# EAGLE design driver (EAGLE 5.10)
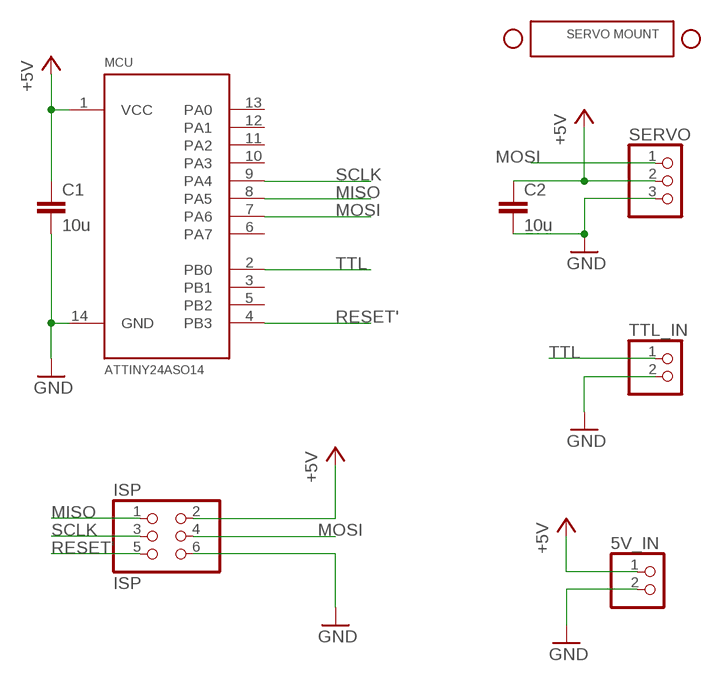
[diagram p0: schematic, sheet 1]

## Parts
5V_IN  PINHD-1X2/90  [1X02/90]
C1  10u  C-EUC0805  [C0805]
C2  10u  C-EUC0805  [C0805]
ISP  ISP  PINHD-2X3  [2X03]
MCU  ATTINY24ASO14  [SO14]
SERVO  PINHD-1X3/90  [1X03/90]
TTL_IN  PINHD-1X2/90  [1X02/90]
U$2  HYPERIONDS09  [HYPERIONDS09]

## Nets
+5V: 5V_IN.1 C1.1 C2.1 ISP.2 MCU.1(VCC) SERVO.2
GND: 5V_IN.2 C1.2 C2.2 ISP.6 MCU.14(GND) SERVO.3 TTL_IN.2
MISO: ISP.1 MCU.8(PA5)
MOSI: ISP.4 MCU.7(PA6) SERVO.1
RESET': ISP.5 MCU.4(PB3)
SCLK: ISP.3 MCU.9(PA4)
TTL: MCU.2(PB0) TTL_IN.1
Unconnected: MCU.3(PB1) MCU.5(PB2) MCU.6(PA7) MCU.10(PA3) MCU.11(PA2) MCU.12(PA1) MCU.13(PA0)

## Library data of the parts
5V_IN TTL_IN = pinhead:PINHD-1X2: PIN HEADER
C1 C2 = resistor:C-EU: CAPACITOR, European symbol
ISP = pinhead:PINHD-2X3: PIN HEADER
MCU = custom_parts:ATTINY24A
SERVO = pinhead:PINHD-1X3: PIN HEADER
U$2 = custom_parts:HYPERIONDS09

## Board
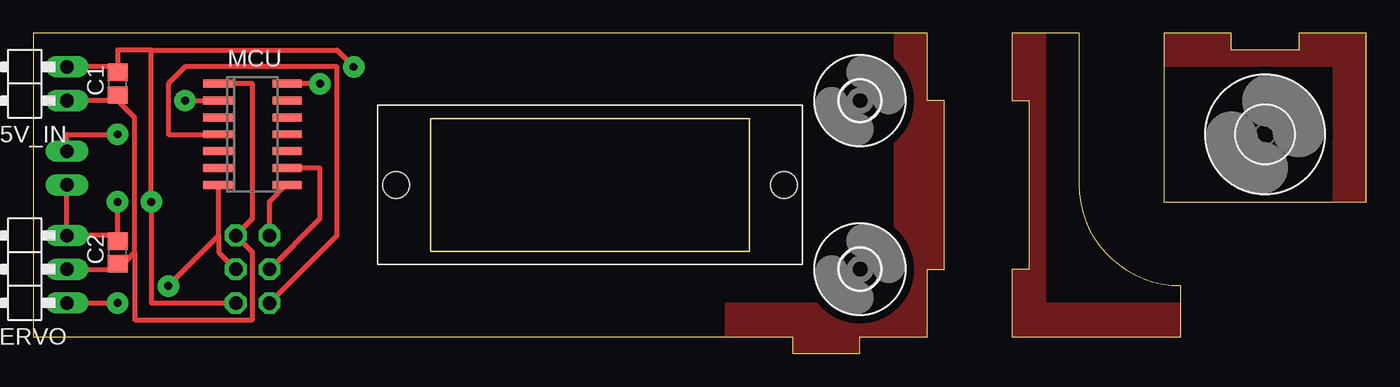
[diagram p1: board, top side]
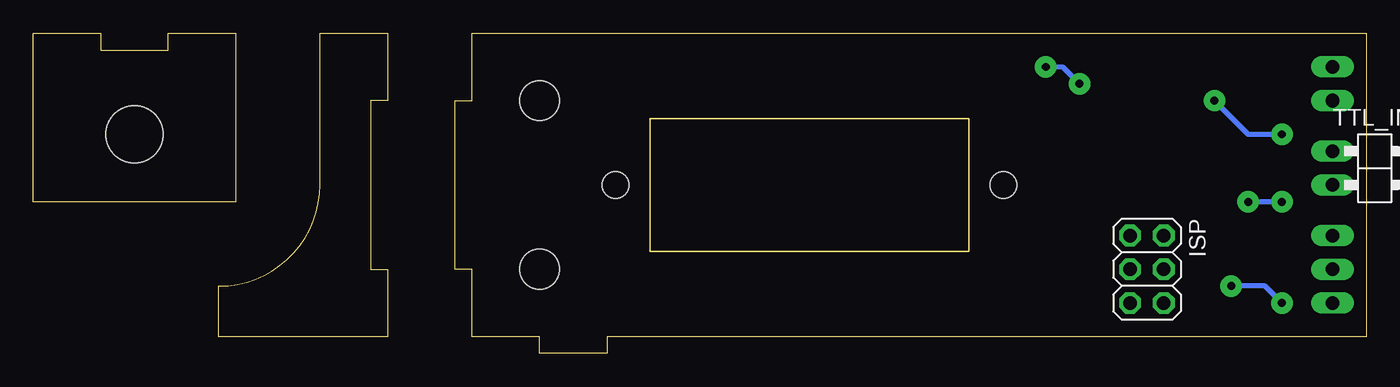
[diagram p2: board, bottom side, seen from below]

Size 100.33 x 24.13 mm. Coordinates in mm from the lower left corner, seen from the top.
Outline: 73.66,24.13 73.66,19.05 74.93,19.05 74.93,6.35 73.66,6.35 73.66,1.27 86.36,1.27 86.36,5.08 arc-90 78.74,12.7 78.74,24.13 73.66,24.13
Outline: 100.33,24.13 95.25,24.13 95.25,22.86 90.17,22.86 90.17,24.13 85.09,24.13 85.09,11.43 100.33,11.43 100.33,24.13
Outline: 0,1.27 57.15,1.27 57.15,0 62.23,0 62.23,1.27 67.31,1.27 67.31,6.35 68.58,6.35 68.58,19.05 67.31,19.05 67.31,24.13 0,24.13 0,1.27
Copper layers (1*16): Top 0.035mm / dielectric 1.5mm / Bottom 0.035mm
Design rules "default *": minimum track width 15mil, minimum drill 0.6mm, track to track 10mil, track to pad 10mil, pad to pad 10mil, via to via 10mil, smd to smd 10mil, copper to edge 0mil, drill to drill 8mil, minimum pad ring 10mil, minimum via ring 20mil, stop-mask expansion 4mil, vias tented up to drill 0mil, thermal gap 10mil
bRestrict: area 14,2.5 to 19.1,10.2; area 1.3,17.8 to 3.8,22.9; area 1.3,11.4 to 3.8,16.5; area 1.3,2.5 to 3.8,10.2
vRestrict: area 12.7,11.4 to 20.3,21.6

### Footprints (pad centres in the part's own frame; a part is rotated, then mirrored left to right if it is on the bottom)
1X02/90 = drill 1.016 long: 1 -1.27,-3.81; 2 1.27,-3.81
C0805 = smd 1.3 x 1.5: 1 -0.85,0; 2 0.85,0
2X03 = drill 1.016 octagon: 1 -2.54,-1.27; 2 -2.54,1.27; 3 0,-1.27; 4 0,1.27; 5 2.54,-1.27; 6 2.54,1.27
SO14 = smd 0.6 x 2.2: 1 -3.81,-2.6; 2 -2.54,-2.6; 3 -1.27,-2.6; 4 0,-2.6; 5 1.27,-2.6; 6 2.54,-2.6; 7 3.81,-2.6; 8 3.81,2.6; 9 2.54,2.6; 10 1.27,2.6; 11 0,2.6; 12 -1.27,2.6; 13 -2.54,2.6; 14 -3.81,2.6
1X03/90 = drill 1.016 long: 1 -2.54,-3.81; 2 0,-3.81; 3 2.54,-3.81
3,0 = hole 3: 0,0
HYPERIONDS09 = hole 2: -14.6,0; 14.6,0
4,3 = hole 4.3: 0,0

### Placement (x,y rotation side)
5V_IN  -1.27,20.32 90 top
C1  6.35,20.32 90 top
C2  6.35,7.62 90 top
ISP  16.51,6.35 270 bottom
MCU  16.51,16.51 270 top
SERVO  -1.27,6.35 90 top
TTL_IN  -1.27,13.97 270 bottom
U$1  [3,0]  62.23,6.35 0 top
U$2  41.91,12.7 0 top
U$3  [3,0]  62.23,19.05 0 top
U$4  [4,3]  92.71,16.51 0 top

### Tracks (layer width: path | path; a pad name or v marks a point on that pad's centre or on a via)
+5V
  Top 0.381: MCU.1 16.51,20.32 16.51,10.16 ISP.2 16.51,7.62 16.51,2.54 7.62,2.54 7.62,7.62 | SERVO.2 6.35,6.35 | 6.35,19.05 5V_IN.1 | 6.35,6.35 7.62,7.62 | 7.62,7.62 7.62,17.78 6.35,19.05 | 6.35,6.35 C2.1 | 6.35,19.05 C1.1
GND  (via drill 0.6)
  Top 0.381: 6.35,8.89 SERVO.3 TTL_IN.2 | 6.35,21.59 5V_IN.2 | v21.59,20.32 MCU.14 19.05,20.32 | v24.13,21.59 22.86,22.86 8.89,22.86 | 8.89,22.86 6.35,22.86 6.35,21.59 | 6.35,21.59 C1.2 | ISP.6 8.89,3.81 v8.89,11.43 8.89,22.86 | 6.35,8.89 v6.35,11.43 | C2.2 6.35,8.89
  Bottom 0.381: v21.59,20.32 22.86,21.59 v24.13,21.59 | v6.35,11.43 v8.89,11.43
MISO
  Top 0.381: ISP.1 17.78,11.43 19.05,12.7 MCU.8
MOSI  (via drill 0.6)
  Top 0.381: 13.97,8.89 13.97,7.62 ISP.4 | 13.97,8.89 13.97,12.7 MCU.7 | SERVO.1 v6.35,3.81 | v10.16,5.08 13.97,8.89
  Bottom 0.381: v6.35,3.81 7.62,5.08 v10.16,5.08
N$1
  pour Top: 64.77,24.13 64.77,3.81 52.07,3.81 52.07,1.27 57.15,1.27 57.15,0 62.23,0 62.23,1.27 67.31,1.27 67.31,6.35 68.58,6.35 68.58,19.05 67.31,19.05 67.31,24.13
N$2
  pour Top: 76.2,24.13 76.2,3.81 86.36,3.81 86.36,1.27 73.66,1.27 73.66,6.35 74.93,6.35 74.93,19.05 73.66,19.05 73.66,24.13
N$3
  pour Top: 85.09,24.13 85.09,21.59 97.79,21.59 97.79,11.43 100.33,11.43 100.33,24.13 95.25,24.13 95.25,22.86 90.17,22.86 90.17,24.13
RESET'
  Top 0.381: ISP.5 22.86,8.89 22.86,21.59 11.43,21.59 10.16,20.32 10.16,16.51 MCU.4 13.97,16.51
SCLK
  Top 0.381: ISP.3 21.59,10.16 21.59,13.97 MCU.9 19.05,13.97
TTL  (via drill 0.6)
  Top 0.381: v11.43,19.05 MCU.2 13.97,19.05 | v6.35,16.51 2.54,16.51 TTL_IN.1
  Bottom 0.381: v11.43,19.05 8.89,16.51 v6.35,16.51